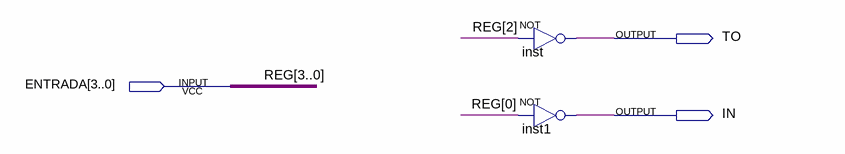
[diagram p0: schematic sheet]
// Quartus schematic ESCOLHE_REG.bdf as structural Verilog: 2 symbols, 3 pins
module ESCOLHE_REG (
  input  [3:0] ENTRADA,
  output TO,
  output IN
);

  not inst (TO, ENTRADA[2]);
  not inst1 (IN, ENTRADA[0]);

  // Other names for the same wires on the sheet: REG[3:0] = ENTRADA
endmodule
